# EAGLE design MDR50-Breakout (EAGLE 7.3.0)
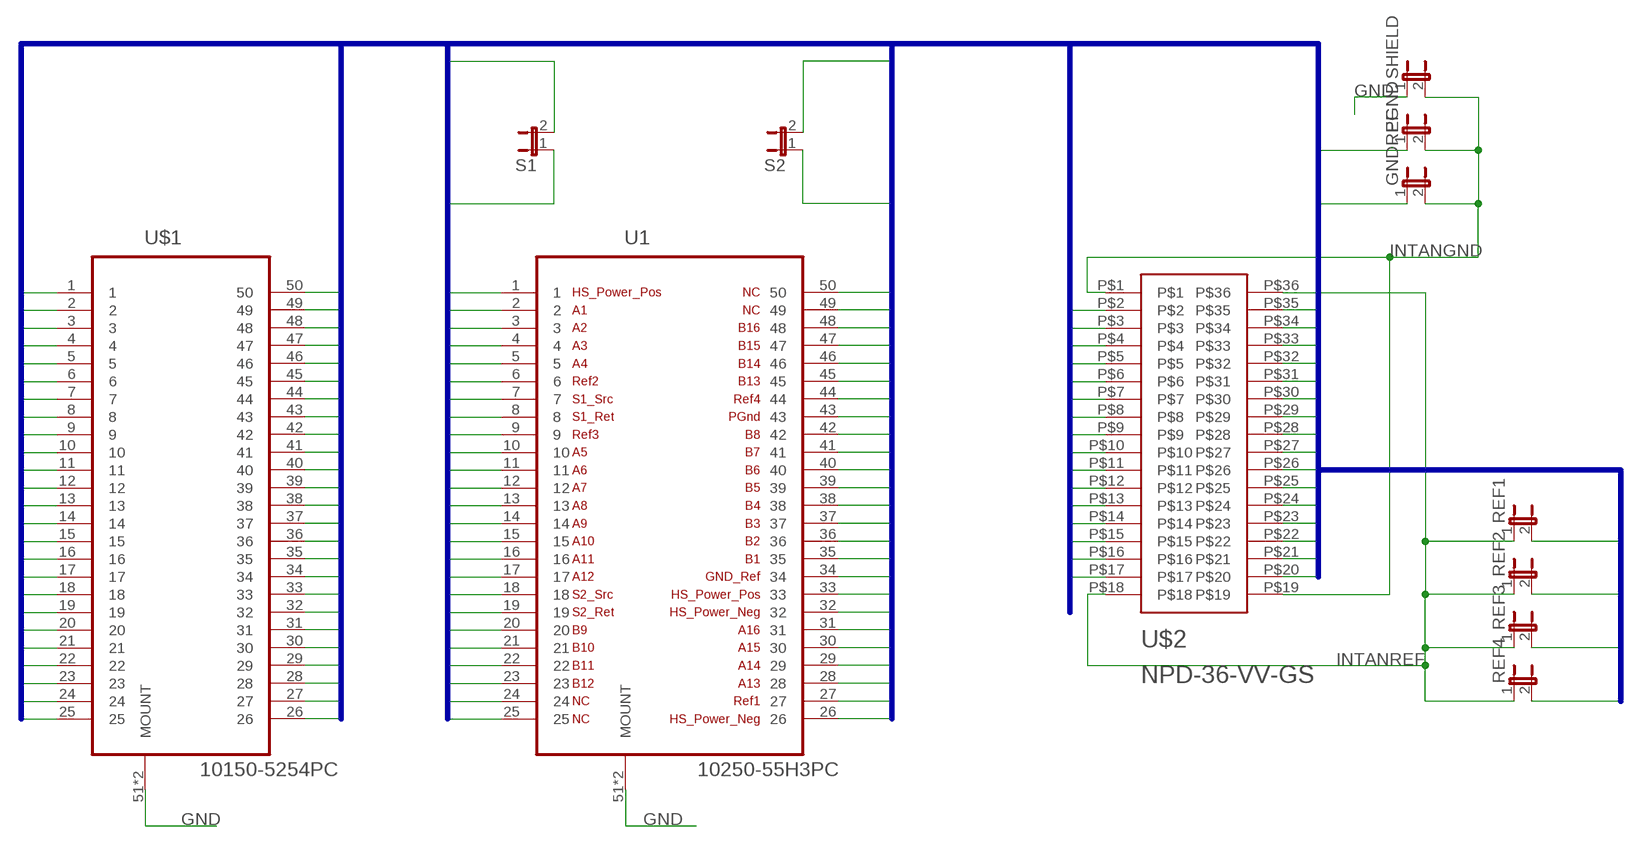
[diagram p0: schematic, sheet 1]

## Parts
GNDREF  JUMPER-2PTH  [1X02]
PGND  JUMPER-2PTH  [1X02]
REF1  JUMPER-2PTH  [1X02]
REF2  JUMPER-2PTH  [1X02]
REF3  JUMPER-2PTH  [1X02]
REF4  JUMPER-2PTH  [1X02]
S1  JUMPER-2PTH  [1X02]
S2  JUMPER-2PTH  [1X02]
SHIELD  JUMPER-2PTH  [1X02]
U1  10250-55H3PC  [3M_10250-55H3PC]
U$1  10150-5254PC  [3M_10150-5242PC]
U$2  NPD-36-VV-GS  [NPD-36-VV-GS]

## Nets
D1: U1.1 U$1.1
D2: U1.2 U$1.2 U$2.P$10
D3: U1.3 U$1.3 U$2.P$11
D4: U1.4 U$1.4 U$2.P$12
D5: U1.5 U$1.5 U$2.P$13
D6: REF2.2 U1.6 U$1.6
D7: S1.1 U1.7 U$1.7
D8: S1.2 U1.8 U$1.8
D9: REF3.2 U1.9 U$1.9
D10: U1.10 U$1.10 U$2.P$14
D11: U1.11 U$1.11 U$2.P$15
D12: U1.12 U$1.12 U$2.P$16
D13: U1.13 U$1.13 U$2.P$17
D14: U1.14 U$1.14 U$2.P$20
D15: U1.15 U$1.15 U$2.P$21
D16: U1.16 U$1.16 U$2.P$22
D17: U1.17 U$1.17 U$2.P$23
D18: S2.1 U1.18 U$1.18
D19: S2.2 U1.19 U$1.19
D20: U1.20 U$1.20 U$2.P$2
D21: U1.21 U$1.21 U$2.P$3
D22: U1.22 U$1.22 U$2.P$4
D23: U1.23 U$1.23 U$2.P$5
D24: U1.24 U$1.24
D25: U1.25 U$1.25
D26: U1.26 U$1.26
D27: REF1.2 U1.27 U$1.27
D28: U1.28 U$1.28 U$2.P$24
D29: U1.29 U$1.29 U$2.P$25
D30: U1.30 U$1.30 U$2.P$26
D31: U1.31 U$1.31 U$2.P$27
D32: U1.32 U$1.32
D33: U1.33 U$1.33
D34: GNDREF.1 U1.34 U$1.34
D35: U1.35 U$1.35 U$2.P$28
D36: U1.36 U$1.36 U$2.P$29
D37: U1.37 U$1.37 U$2.P$30
D38: U1.38 U$1.38 U$2.P$31
D39: U1.39 U$1.39 U$2.P$32
D40: U1.40 U$1.40 U$2.P$33
D41: U1.41 U$1.41 U$2.P$34
D42: U1.42 U$1.42 U$2.P$35
D43: PGND.1 U1.43 U$1.43
D44: REF4.2 U1.44 U$1.44
D45: U1.45 U$1.45 U$2.P$6
D46: U1.46 U$1.46 U$2.P$7
D47: U1.47 U$1.47 U$2.P$8
D48: U1.48 U$1.48 U$2.P$9
D49: U1.49 U$1.49
D50: U1.50 U$1.50
GND: SHIELD.1 U1.51(MOUNT) U1.52(MOUNT) U$1.51(MOUNT) U$1.52(MOUNT)
INTANGND: GNDREF.2 PGND.2 SHIELD.2 U$2.P$1 U$2.P$19
INTANREF: REF1.1 REF2.1 REF3.1 REF4.1 U$2.P$18 U$2.P$36

## Buses
D[1..50]

## Library data of the parts
GNDREF PGND REF1-REF4 S1 S2 SHIELD = SparkFun:JUMPER-2: Jumper Basic 0.1" spaced jumper. Use with breakaway headers.
U1 = UsefulConnectors:10250-55H3PC: CONN MDR RCPT 50POS R/A 4-40; MPN: 10250-55H3PC; OC_FARNELL: 1428338; OC_NEWARK: 69K7227; PACKAGE: MDR RCPT 50POS R/A 4-40; SUPPLIER: 3M
U$1 = UsefulConnectors:10150-5254PC: CONN MDR PLUG 50POS R/A 4-40
U$2 = Connectors:NPD-36-VV-GS: Omnetics 36-pin connector, vertical surface-mount

## Board
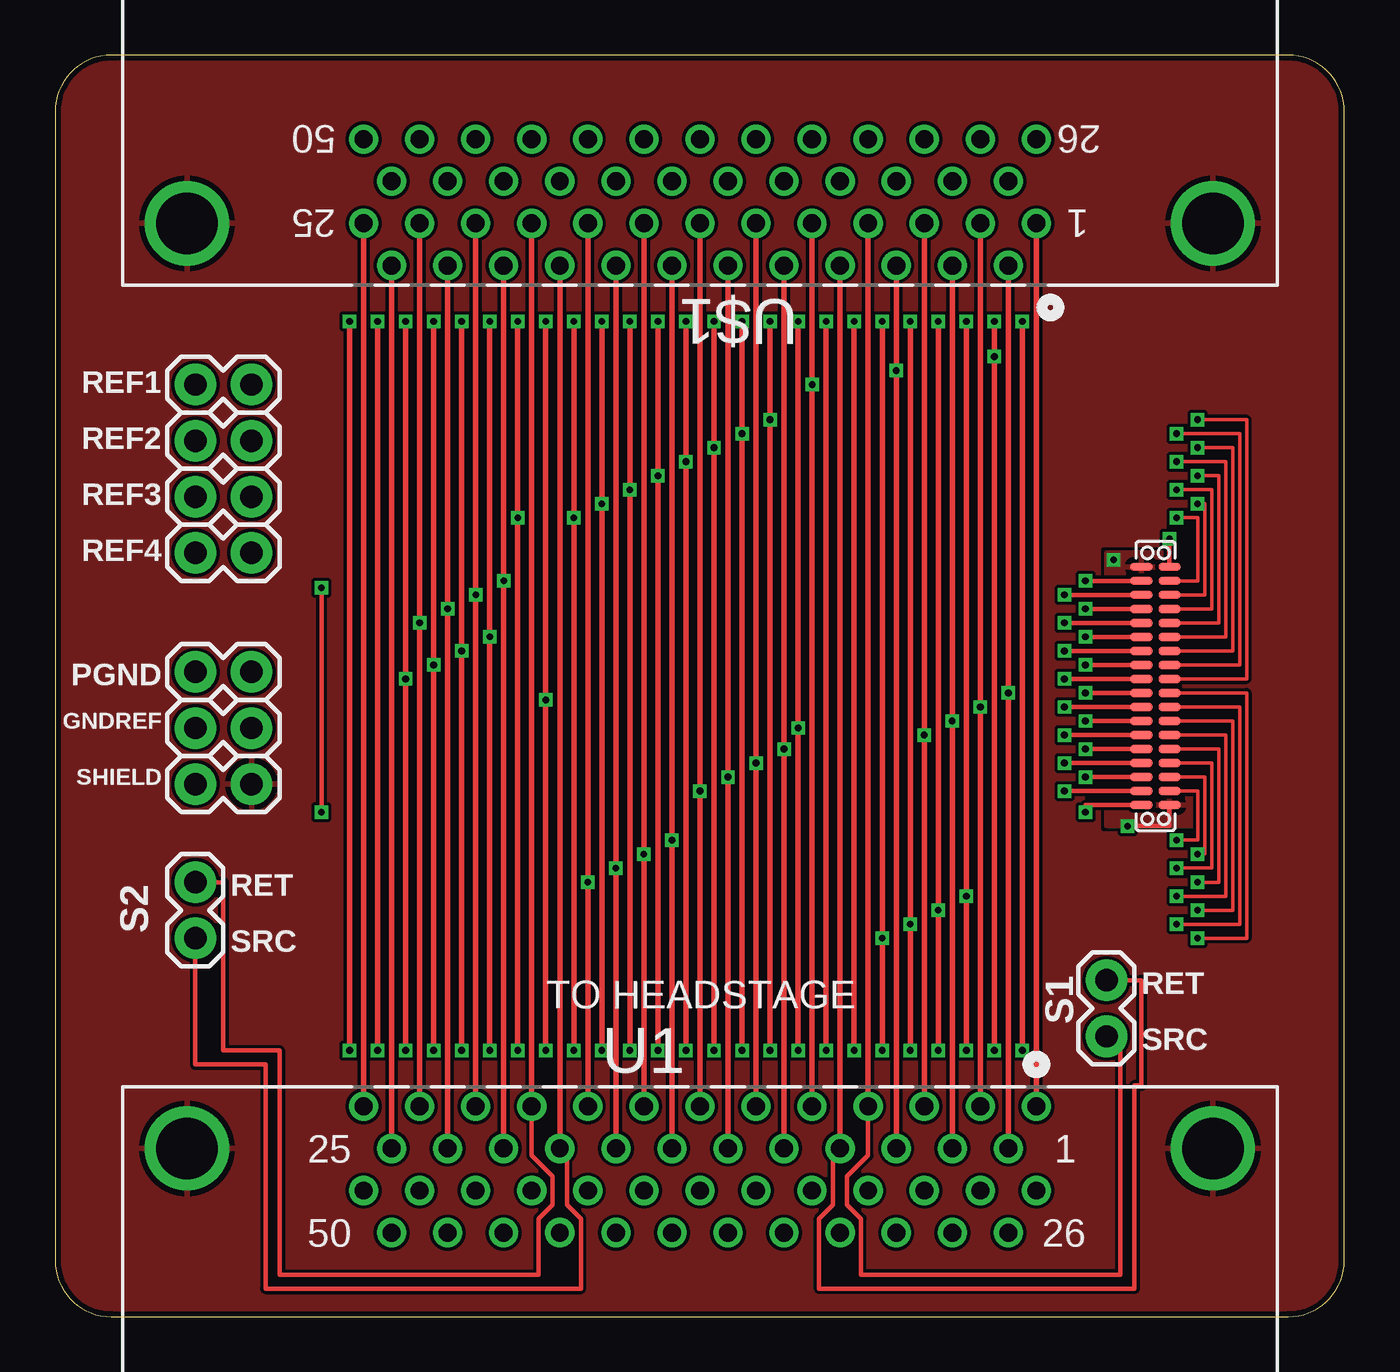
[diagram p1: board, top side]
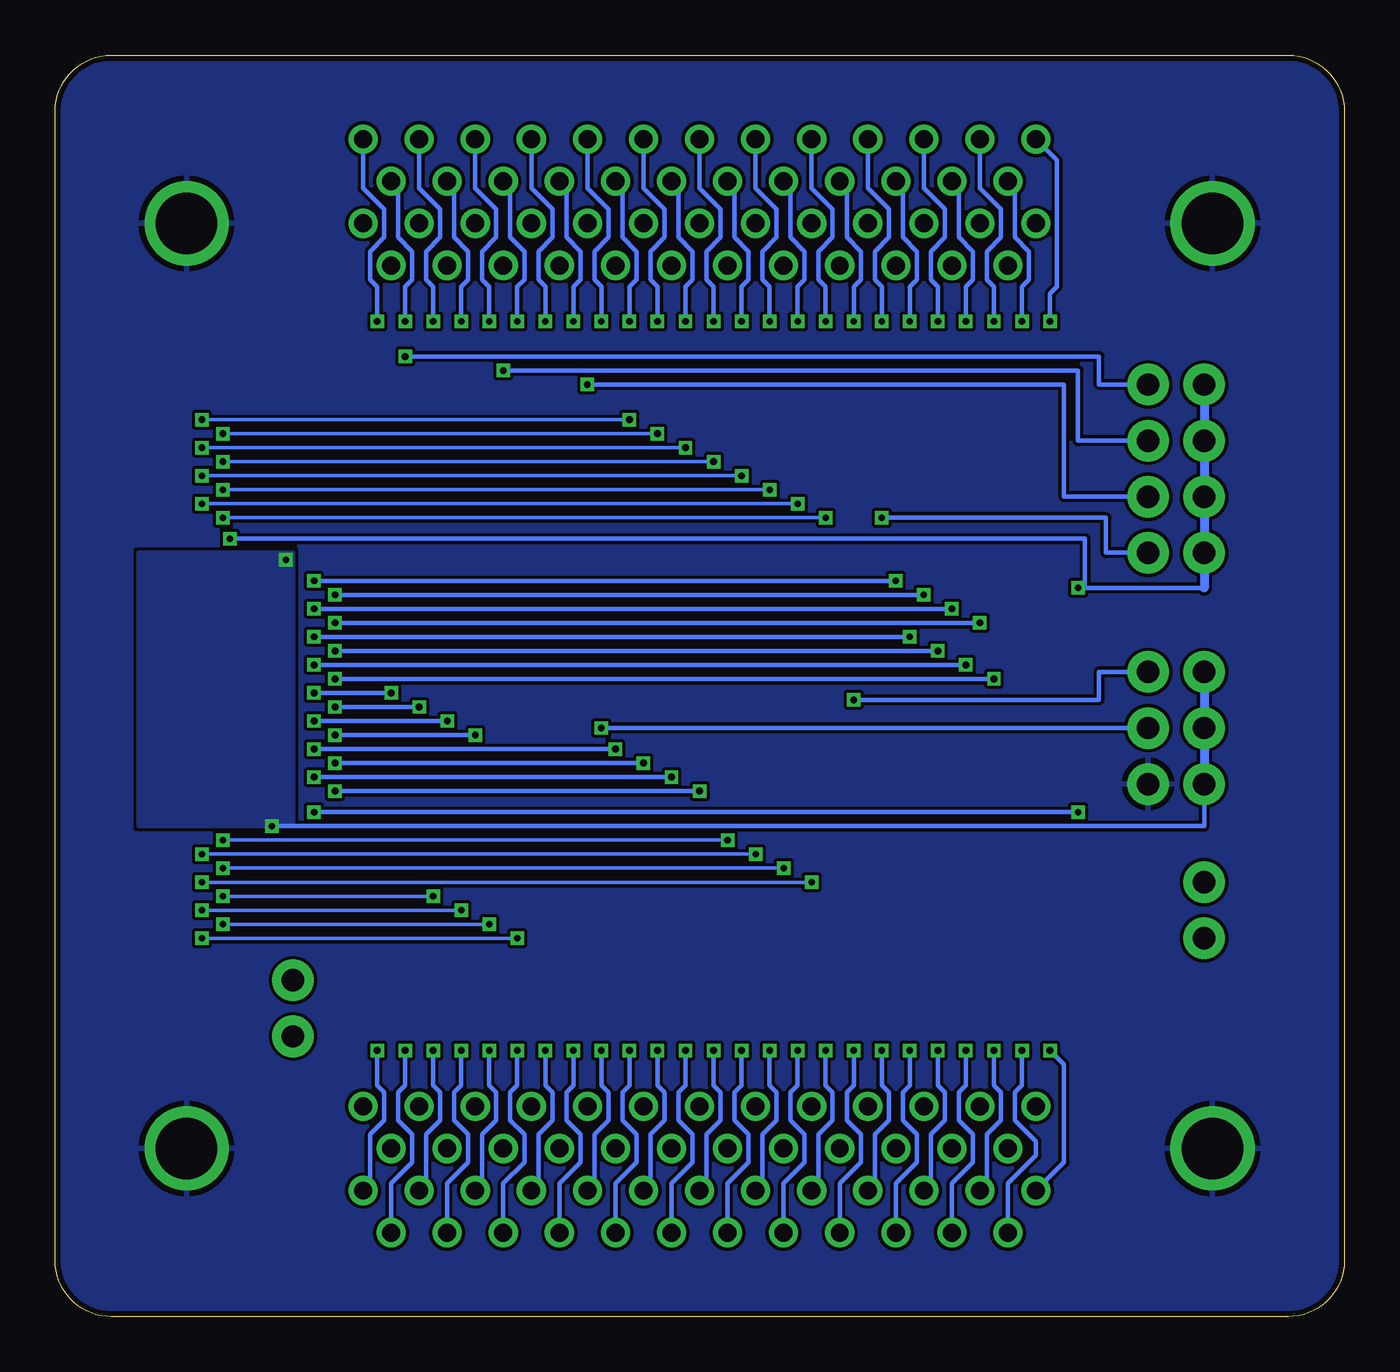
[diagram p2: board, bottom side, seen from below]

Size 58.4 x 57.15 mm. Coordinates in mm from the lower left corner, seen from the top.
Outline: 0,54.61 0,2.54 arc90 2.54,0 55.86,0 arc90 58.4,2.54 58.4,54.61 arc90 55.86,57.15 2.54,57.15 arc90 0,54.61
Copper layers (1*16): Top 0.035mm / dielectric 1.5mm / Bottom 0.035mm
Design rules "Seeed_DRU *": minimum track width 6mil, minimum drill 12mil, track to track 6mil, track to pad 6mil, pad to pad 6mil, via to via 6mil, smd to smd 0mil, copper to edge 10mil, drill to drill 10mil, minimum pad ring 10mil, minimum via ring 6mil, stop-mask expansion 2mil, vias tented up to drill 100mil, thermal gap 10mil

### Footprints (pad centres in the part's own frame; a part is rotated, then mirrored left to right if it is on the bottom)
1X02 = drill 1.016 pad 1.88: 1 0,0; 2 2.54,0
3M_10250-55H3PC = drill 0.813: 1 30.48,5.715; 2 29.21,3.81; 3 27.94,5.715; 4 26.67,3.81; 5 25.4,5.715; 6 24.13,3.81; 7 22.86,5.715; 8 21.59,3.81; 9 20.32,5.715; 10 19.05,3.81; 11 17.78,5.715; 12 16.51,3.81; 13 15.24,5.715; 14 13.97,3.81; 15 12.7,5.715; 16 11.43,3.81; 17 10.16,5.715; 18 8.89,3.81; 19 7.62,5.715; 20 6.35,3.81; 21 5.08,5.715; 22 3.81,3.81; 23 2.54,5.715; 24 1.27,3.81; 25 0,5.715; 26 30.48,1.905; 27 29.21,0; 28 27.94,1.905; 29 26.67,0; 30 25.4,1.905; 31 24.13,0; 32 22.86,1.905; 33 21.59,0; 34 20.32,1.905; 35 19.05,0; 36 17.78,1.905; 37 16.51,0; 38 15.24,1.905; 39 13.97,0; 40 12.7,1.905; 41 11.43,0; 42 10.16,1.905; 43 8.89,0; 44 7.62,1.905; 45 6.35,0; 46 5.08,1.905; 47 3.81,0; 48 2.54,1.905; 49 1.27,0; 50 0,1.905 | drill 2.794: 51 -8.001,3.81; 52 38.481,3.81
3M_10150-5242PC = drill 0.813: 1 -15.24,6.35; 2 -13.97,8.255; 3 -12.7,6.35; 4 -11.43,8.255; 5 -10.16,6.35; 6 -8.89,8.255; 7 -7.62,6.35; 8 -6.35,8.255; 9 -5.08,6.35; 10 -3.81,8.255; 11 -2.54,6.35; 12 -1.27,8.255; 13 0,6.35; 14 1.27,8.255; 15 2.54,6.35; 16 3.81,8.255; 17 5.08,6.35; 18 6.35,8.255; 19 7.62,6.35; 20 8.89,8.255; 21 10.16,6.35; 22 11.43,8.255; 23 12.7,6.35; 24 13.97,8.255; 25 15.24,6.35; 26 -15.24,2.54; 27 -13.97,4.445; 28 -12.7,2.54; 29 -11.43,4.445; 30 -10.16,2.54; 31 -8.89,4.445; 32 -7.62,2.54; 33 -6.35,4.445; 34 -5.08,2.54; 35 -3.81,4.445; 36 -2.54,2.54; 37 -1.27,4.445; 38 0,2.54; 39 1.27,4.445; 40 2.54,2.54; 41 3.81,4.445; 42 5.08,2.54; 43 6.35,4.445; 44 7.62,2.54; 45 8.89,4.445; 46 10.16,2.54; 47 11.43,4.445; 48 12.7,2.54; 49 13.97,4.445; 50 15.24,2.54 | drill 2.794: 51 -23.241,6.35; 52 23.241,6.35
NPD-36-VV-GS = smd 0.381 x 1.016: P$1 0,0; P$2 0.635,0; P$3 1.27,0; P$4 1.905,0; P$5 2.54,0; P$6 3.175,0; P$7 3.81,0; P$8 4.445,0; P$9 5.08,0; P$10 5.715,0; P$11 6.35,0; P$12 6.985,0; P$13 7.62,0; P$14 8.255,0; P$15 8.89,0; P$16 9.525,0; P$17 10.16,0; P$18 10.795,0; P$19 10.795,1.27; P$20 10.16,1.27; P$21 9.525,1.27; P$22 8.89,1.27; P$23 8.255,1.27; P$24 7.62,1.27; P$25 6.985,1.27; P$26 6.35,1.27; P$27 5.715,1.27; P$28 5.08,1.27; P$29 4.445,1.27; P$30 3.81,1.27; P$31 3.175,1.27; P$32 2.54,1.27; P$33 1.905,1.27; P$34 1.27,1.27; P$35 0.635,1.27; P$36 0,1.27

### Placement (x,y rotation side)
GNDREF  8.89,26.67 180 top
PGND  8.89,29.21 180 top
REF1  6.35,42.23 0 top
REF2  6.35,39.69 0 top
REF3  6.35,37.15 0 top
REF4  6.35,34.61 0 top
S1  47.62,12.7 90 top
S2  6.35,17.14 90 top
SHIELD  8.89,24.13 180 top
U1  13.97,3.81 0 top
U$1  29.21,55.88 180 top
U$2  49.21,33.97 270 top

### Tracks (layer width: path | path; a pad name or v marks a point on that pad's centre or on a via)
D1
  Top 0.254: U1.1 U$1.1
D2  (via drill 0.3)
  Top 0.203: v46.67,28.26 U$2.P$10
  Top 0.254: U1.2 v43.18,28.26 U$1.2
  Bottom 0.203: v46.67,28.26 v43.18,28.26
D3  (via drill 0.3)
  Top 0.203: v45.72,27.62 U$2.P$11
  Top 0.254: U1.3 v41.91,27.62 U$1.3
  Bottom 0.203: v45.72,27.62 v41.91,27.62
D4  (via drill 0.3)
  Top 0.203: v46.67,26.99 U$2.P$12
  Top 0.254: U$1.4 v40.64,26.99 U1.4
  Bottom 0.203: v46.67,26.99 v40.64,26.99
D5  (via drill 0.3)
  Top 0.203: v45.72,26.35 U$2.P$13
  Top 0.254: U1.5 v39.37,26.35 U$1.5
  Bottom 0.203: v45.72,26.35 v39.37,26.35
D6  (via drill 0.3)
  Top 0.254: U$1.6 v38.1,42.86 U1.6
  Bottom 0.203: REF2.2 12.06,39.69 12.06,42.86 v38.1,42.86
D7
  Top 0.203: S1.1 48.26,12.06 48.26,1.91 36.51,1.91 36.51,4.45 35.88,5.08 35.88,6.35 36.83,7.3 U1.7
  Top 0.254: U$1.7 U1.7
D8
  Top 0.203: S1.2 49.21,15.24 49.21,10.48 48.9,10.48 48.9,1.27 34.61,1.27 34.61,4.45 35.24,5.08 35.24,7.3 U1.8
  Top 0.254: U1.8 U$1.8
D9  (via drill 0.3)
  Top 0.254: U$1.9 v34.29,42.23 U1.9
  Bottom 0.203: REF3.2 12.7,37.15 12.7,42.23 v34.29,42.23
D10  (via drill 0.3)
  Top 0.203: U$2.P$14 v46.67,25.72
  Top 0.254: U1.10 v33.02,25.72 U$1.10
  Bottom 0.203: v46.67,25.72 v33.02,25.72
D11  (via drill 0.3)
  Top 0.203: U$2.P$15 v45.72,25.08
  Top 0.254: U$1.11 v31.75,25.08 U1.11
  Bottom 0.203: v45.72,25.08 v31.75,25.08
D12  (via drill 0.3)
  Top 0.203: U$2.P$16 v46.67,24.45
  Top 0.254: U$1.12 v30.48,24.45 U1.12
  Bottom 0.203: v46.67,24.45 v30.48,24.45
D13  (via drill 0.3)
  Top 0.203: U$2.P$17 v45.72,23.81
  Top 0.254: U$1.13 v29.21,23.81 U1.13
  Bottom 0.203: v45.72,23.81 v29.21,23.81
D14  (via drill 0.3)
  Top 0.152: U$2.P$20 51.75,23.81 51.75,21.59 v50.8,21.59
  Top 0.254: U$1.14 v27.94,21.59 U1.14
  Bottom 0.152: v50.8,21.59 v27.94,21.59
D15  (via drill 0.3)
  Top 0.152: U$2.P$21 52.07,24.45 52.07,20.95 v51.75,20.95
  Top 0.254: U$1.15 v26.67,20.95 U1.15
  Bottom 0.152: v51.75,20.95 v26.67,20.95
D16  (via drill 0.3)
  Top 0.152: U$2.P$22 52.39,25.08 52.39,20.32 v50.8,20.32
  Top 0.254: U$1.16 v25.4,20.32 U1.16
  Bottom 0.152: v50.8,20.32 v25.4,20.32
D17  (via drill 0.3)
  Top 0.152: U$2.P$23 52.7,25.72 52.7,19.68 v51.75,19.68
  Top 0.254: U1.17 v24.13,19.68 U$1.17
  Bottom 0.152: v51.75,19.68 v24.13,19.68
D18
  Top 0.203: S2.1 6.35,11.43 9.53,11.43 9.53,1.27 23.81,1.27 23.81,4.45 23.18,5.08 23.18,7.3 U1.18
  Top 0.254: U$1.18 U1.18
D19
  Top 0.203: S2.2 7.62,19.68 7.62,12.06 10.16,12.06 10.16,1.91 21.91,1.91 21.91,4.45 22.54,5.08 22.54,6.35 21.59,7.3 U1.19
  Top 0.254: U$1.19 U1.19
D20  (via drill 0.3)
  Top 0.203: U$2.P$2 v46.67,33.34
  Top 0.254: U1.20 v20.32,33.34 U$1.20
  Bottom 0.203: v46.67,33.34 v20.32,33.34
D21  (via drill 0.3)
  Top 0.203: U$2.P$3 v45.72,32.7
  Top 0.254: U$1.21 v19.05,32.7 U1.21
  Bottom 0.203: v45.72,32.7 v19.05,32.7
D22  (via drill 0.3)
  Top 0.203: U$2.P$4 v46.67,32.07
  Top 0.254: U1.22 v17.78,32.07 U$1.22
  Bottom 0.203: v46.67,32.07 v17.78,32.07
D23  (via drill 0.3)
  Top 0.203: U$2.P$5 v45.72,31.43
  Top 0.254: U$1.23 v16.51,31.43 U1.23
  Bottom 0.203: v45.72,31.43 v16.51,31.43
D24
  Top 0.254: U1.24 U$1.24
D25
  Top 0.254: U$1.25 U1.25
D26  (via drill 0.3)
  Top 0.254: v43.81,45.09 v43.81,12.06
  Bottom 0.203: U1.26 44.13,6.03 44.13,8.26 43.5,8.89 43.5,10.16 43.81,10.48 v43.81,12.06 | U$1.26 44.45,51.12 43.5,50.16 43.5,48.9 44.13,48.26 44.13,46.99 43.81,46.67 v43.81,45.09
D27  (via drill 0.3)
  Top 0.254: v42.55,45.09 v42.55,43.5 v42.55,12.06
  Bottom 0.203: U1.27 43.18,6.03 42.23,6.99 42.23,8.26 42.86,8.89 42.86,10.16 42.55,10.48 v42.55,12.06 | U$1.27 42.86,51.12 42.86,48.9 42.23,48.26 42.23,46.99 42.55,46.67 v42.55,45.09 | REF1.2 11.11,42.23 11.11,43.5 v42.55,43.5
D28  (via drill 0.3)
  Top 0.152: U$2.P$24 53.02,26.35 53.02,19.05 v50.8,19.05
  Top 0.254: v41.27,45.09 v41.27,19.05 v41.27,12.06
  Bottom 0.152: v50.8,19.05 v41.27,19.05
  Bottom 0.203: U1.28 41.59,6.03 41.59,8.26 40.96,8.89 40.96,10.16 41.27,10.48 v41.27,12.06 | U$1.28 41.91,51.12 40.96,50.16 40.96,48.9 41.59,48.26 41.59,46.99 41.27,46.67 v41.27,45.09
D29  (via drill 0.3)
  Top 0.152: U$2.P$25 53.34,26.99 53.34,18.41 v51.75,18.41
  Top 0.254: v40.01,45.09 v40.01,18.41 v40.01,12.06
  Bottom 0.152: v51.75,18.41 v40.01,18.41
  Bottom 0.203: U1.29 40.64,6.03 39.69,6.99 39.69,8.26 40.32,8.89 40.32,10.16 40.01,10.48 v40.01,12.06 | U$1.29 40.32,51.12 40.32,48.9 39.69,48.26 39.69,46.99 40.01,46.67 v40.01,45.09
D30  (via drill 0.3)
  Top 0.152: U$2.P$26 53.66,27.62 53.66,17.78 v50.8,17.78
  Top 0.254: v38.73,45.09 v38.73,17.78 v38.73,12.06
  Bottom 0.152: v50.8,17.78 v38.73,17.78
  Bottom 0.203: U1.30 39.05,6.03 39.05,8.26 38.42,8.89 38.42,10.16 38.73,10.48 v38.73,12.06 | U$1.30 39.37,51.12 38.42,50.16 38.42,48.9 39.05,48.26 39.05,46.99 38.73,46.67 v38.73,45.09
D31  (via drill 0.3)
  Top 0.152: U$2.P$27 53.98,28.26 53.98,17.14 v51.75,17.14
  Top 0.254: v37.47,45.09 v37.47,17.14 v37.47,12.06
  Bottom 0.152: v51.75,17.14 v37.47,17.14
  Bottom 0.203: U1.31 38.1,6.03 37.15,6.99 37.15,8.26 37.78,8.89 37.78,10.16 37.47,10.48 v37.47,12.06 | U$1.31 37.78,51.12 37.78,48.9 37.15,48.26 37.15,46.99 37.47,46.67 v37.47,45.09
D32  (via drill 0.3)
  Top 0.254: v36.2,45.09 v36.2,12.06
  Bottom 0.203: U1.32 36.51,6.03 36.51,8.26 35.88,8.89 35.88,10.16 36.2,10.48 v36.2,12.06 | U$1.32 36.83,51.12 35.88,50.16 35.88,48.9 36.51,48.26 36.51,46.99 36.2,46.67 v36.2,45.09
D33  (via drill 0.3)
  Top 0.254: v34.92,45.09 v34.92,12.06
  Bottom 0.203: U1.33 35.56,6.03 34.61,6.99 34.61,8.26 35.24,8.89 35.24,10.16 34.92,10.48 v34.92,12.06 | U$1.33 35.24,51.12 35.24,48.9 34.61,48.26 34.61,46.99 34.92,46.67 v34.92,45.09
D34  (via drill 0.3)
  Top 0.254: v33.66,45.09 v33.66,26.67 v33.66,12.06
  Bottom 0.203: U1.34 33.97,6.03 33.97,8.26 33.34,8.89 33.34,10.16 33.66,10.48 v33.66,12.06 | U$1.34 34.29,51.12 33.34,50.16 33.34,48.9 33.97,48.26 33.97,46.99 33.66,46.67 v33.66,45.09 | GNDREF.1 v33.66,26.67
D35  (via drill 0.3)
  Top 0.152: U$2.P$28 53.98,28.89 53.98,40.64 v51.75,40.64
  Top 0.254: v32.38,45.09 v32.38,40.64 v32.38,12.06
  Bottom 0.152: v51.75,40.64 v32.38,40.64
  Bottom 0.203: U1.35 33.02,6.03 32.07,6.99 32.07,8.26 32.7,8.89 32.7,10.16 32.38,10.48 v32.38,12.06 | U$1.35 32.7,51.12 32.7,48.9 32.07,48.26 32.07,46.99 32.38,46.67 v32.38,45.09
D36  (via drill 0.3)
  Top 0.152: U$2.P$29 53.66,29.53 53.66,40.01 v50.8,40.01
  Top 0.254: v31.11,45.09 v31.11,40.01 v31.11,12.06
  Bottom 0.152: v50.8,40.01 v31.11,40.01
  Bottom 0.203: U1.36 31.43,6.03 31.43,8.26 30.8,8.89 30.8,10.16 31.11,10.48 v31.11,12.06 | U$1.36 31.75,51.12 30.8,50.16 30.8,48.9 31.43,48.26 31.43,46.99 31.11,46.67 v31.11,45.09
D37  (via drill 0.3)
  Top 0.152: U$2.P$30 53.34,30.16 53.34,39.37 v51.75,39.37
  Top 0.254: v29.84,45.09 v29.84,39.37 v29.84,12.06
  Bottom 0.152: v51.75,39.37 v29.84,39.37
  Bottom 0.203: U1.37 30.48,6.03 29.53,6.99 29.53,8.26 30.16,8.89 30.16,10.16 29.84,10.48 v29.84,12.06 | U$1.37 30.16,51.12 30.16,48.9 29.53,48.26 29.53,46.99 29.84,46.67 v29.84,45.09
D38  (via drill 0.3)
  Top 0.152: U$2.P$31 53.02,30.8 53.02,38.73 v50.8,38.73
  Top 0.254: v28.57,45.09 v28.57,38.73 v28.57,12.06
  Bottom 0.152: v50.8,38.73 v28.57,38.73
  Bottom 0.203: U1.38 28.89,6.03 28.89,8.26 28.26,8.89 28.26,10.16 28.57,10.48 v28.57,12.06 | U$1.38 29.21,51.12 28.26,50.16 28.26,48.9 28.89,48.26 28.89,46.99 28.57,46.67 v28.57,45.09
D39  (via drill 0.3)
  Top 0.152: U$2.P$32 52.7,31.43 52.7,38.1 v51.75,38.1
  Top 0.254: v27.3,45.09 v27.3,38.1 v27.3,12.06
  Bottom 0.152: v51.75,38.1 v27.3,38.1
  Bottom 0.203: U1.39 27.94,6.03 26.99,6.99 26.99,8.26 27.62,8.89 27.62,10.16 27.3,10.48 v27.3,12.06 | U$1.39 27.62,51.12 27.62,48.9 26.99,48.26 26.99,46.99 27.3,46.67 v27.3,45.09
D40  (via drill 0.3)
  Top 0.152: U$2.P$33 52.39,32.07 52.39,37.47 v50.8,37.47
  Top 0.254: v26.04,45.09 v26.04,37.47 v26.04,12.06
  Bottom 0.152: v50.8,37.47 v26.04,37.47
  Bottom 0.203: U1.40 26.35,6.03 26.35,8.26 25.72,8.89 25.72,10.16 26.04,10.48 v26.04,12.06 | U$1.40 26.67,51.12 25.72,50.16 25.72,48.9 26.35,48.26 26.35,46.99 26.04,46.67 v26.04,45.09
D41  (via drill 0.3)
  Top 0.152: U$2.P$34 52.07,32.7 52.07,36.83 v51.75,36.83
  Top 0.254: v24.77,45.09 v24.77,36.83 v24.77,12.06
  Bottom 0.152: v51.75,36.83 v24.77,36.83
  Bottom 0.203: U1.41 25.4,6.03 24.45,6.99 24.45,8.26 25.08,8.89 25.08,10.16 24.77,10.48 v24.77,12.06 | U$1.41 25.08,51.12 25.08,48.9 24.45,48.26 24.45,46.99 24.77,46.67 v24.77,45.09
D42  (via drill 0.3)
  Top 0.152: U$2.P$35 51.75,33.34 51.75,36.2 v50.8,36.2
  Top 0.254: v23.5,45.09 v23.5,36.2 v23.5,12.06
  Bottom 0.152: v50.8,36.2 v23.5,36.2
  Bottom 0.203: U1.42 23.81,6.03 23.81,8.26 23.18,8.89 23.18,10.16 23.5,10.48 v23.5,12.06 | U$1.42 24.13,51.12 23.18,50.16 23.18,48.9 23.81,48.26 23.81,46.99 23.5,46.67 v23.5,45.09
D43  (via drill 0.3)
  Top 0.254: v22.23,45.09 v22.23,27.94 v22.23,12.06
  Bottom 0.203: U1.43 22.86,6.03 21.91,6.99 21.91,8.26 22.54,8.89 22.54,10.16 22.23,10.48 v22.23,12.06 | U$1.43 22.54,51.12 22.54,48.9 21.91,48.26 21.91,46.99 22.23,46.67 v22.23,45.09 | PGND.1 11.11,29.21 11.11,27.94 v22.23,27.94
D44  (via drill 0.3)
  Top 0.254: v20.95,45.09 v20.95,36.2 v20.95,12.06
  Bottom 0.203: U1.44 21.27,6.03 21.27,8.26 20.64,8.89 20.64,10.16 20.95,10.48 v20.95,12.06 | U$1.44 21.59,51.12 20.64,50.16 20.64,48.9 21.27,48.26 21.27,46.99 20.95,46.67 v20.95,45.09 | REF4.2 10.79,34.61 10.79,36.2 v20.95,36.2
D45  (via drill 0.3)
  Top 0.203: U$2.P$6 v46.67,30.8
  Top 0.254: v19.68,45.09 v19.68,30.8 v19.68,12.06
  Bottom 0.203: U1.45 20.32,6.03 19.37,6.99 19.37,8.26 20,8.89 20,10.16 19.68,10.48 v19.68,12.06 | U$1.45 20,51.12 20,48.9 19.37,48.26 19.37,46.99 19.68,46.67 v19.68,45.09 | v46.67,30.8 v19.68,30.8
D46  (via drill 0.3)
  Top 0.203: U$2.P$7 v45.72,30.16
  Top 0.254: v18.41,45.09 v18.41,30.16 v18.41,12.06
  Bottom 0.203: U1.46 18.73,6.03 18.73,8.26 18.1,8.89 18.1,10.16 18.41,10.48 v18.41,12.06 | U$1.46 19.05,51.12 18.1,50.16 18.1,48.9 18.73,48.26 18.73,46.99 18.41,46.67 v18.41,45.09 | v45.72,30.16 v18.41,30.16
D47  (via drill 0.3)
  Top 0.203: U$2.P$8 v46.67,29.53
  Top 0.254: v17.14,45.09 v17.14,29.53 v17.14,12.06
  Bottom 0.203: v17.14,12.06 17.14,10.48 17.46,10.16 17.46,8.89 16.83,8.26 16.83,6.99 17.78,6.03 U1.47 | U$1.47 17.46,51.12 17.46,48.9 16.83,48.26 16.83,46.99 17.14,46.67 v17.14,45.09 | v46.67,29.53 v17.14,29.53
D48  (via drill 0.3)
  Top 0.203: U$2.P$9 v45.72,28.89
  Top 0.254: v15.88,45.09 v15.88,28.89 v15.88,12.06
  Bottom 0.203: v15.88,12.06 15.88,10.48 15.56,10.16 15.56,8.89 16.19,8.26 16.19,6.03 U1.48 | U$1.48 16.51,51.12 15.56,50.16 15.56,48.9 16.19,48.26 16.19,46.99 15.88,46.67 v15.88,45.09 | v45.72,28.89 v15.88,28.89
D49  (via drill 0.3)
  Top 0.254: v14.61,45.09 v14.61,12.06
  Bottom 0.203: U1.49 15.24,6.03 13.97,7.3 13.97,7.94 14.92,8.89 14.92,10.16 14.61,10.48 v14.61,12.06 | U$1.49 14.92,51.12 14.92,48.9 14.29,48.26 14.29,46.99 14.61,46.67 v14.61,45.09
D50  (via drill 0.3)
  Top 0.254: v13.34,45.09 v13.34,12.06
  Bottom 0.203: U1.50 12.7,6.99 12.7,11.43 v13.34,12.06 | U$1.50 13.02,52.39 13.02,46.67 13.34,46.35 v13.34,45.09
GND
  pour Bottom (rank 2): 0,57.15 58.42,57.15 58.42,0 0,0
  pour Top (rank 2): 0,57.15 58.42,57.15 58.42,0 0,0
INTANGND  (via drill 0.3)
  Top 0.203: U$2.P$19 50.48,22.23 v48.58,22.23
  Bottom 0.203: v48.58,22.23 6.35,22.23 SHIELD.2
  Bottom 0.406: PGND.2 GNDREF.2 SHIELD.2
  other vias: 47.94,34.29
  pour Top: 47.62,34.61 54.61,34.61 54.61,22.23 47.62,22.23
  pour Bottom: 47.62,34.61 54.61,34.61 54.61,22.23 47.62,22.23
INTANREF  (via drill 0.3)
  Top 0.203: U$2.P$36 v50.48,35.24 | U$2.P$18 46.67,23.18 v46.67,22.86 | v12.06,22.86 v12.06,33.02
  Bottom 0.203: v50.48,35.24 11.75,35.24 11.75,33.02 | 6.35,33.02 11.75,33.02 | v46.67,22.86 v12.06,22.86 | 11.75,33.02 v12.06,33.02
  Bottom 0.406: 6.35,33.02 REF4.1 REF3.1 REF2.1 REF1.1

### Text on the board
tNames: RET | SRC | RET | TO HEADSTAGE | SRC